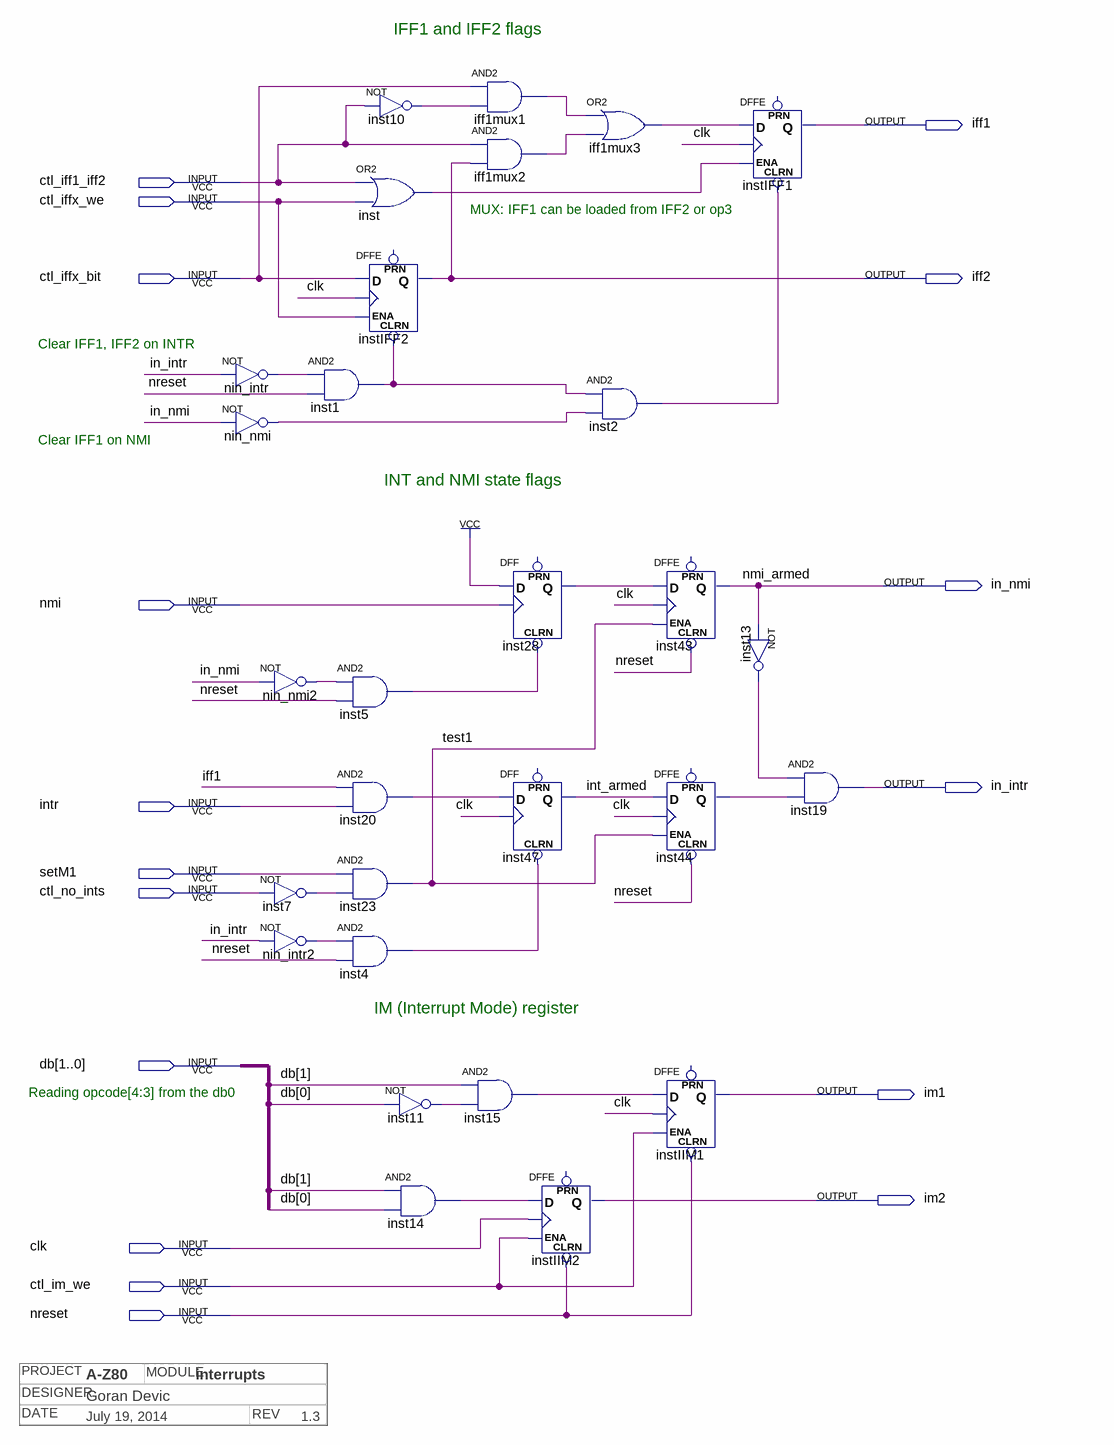
[diagram p0: schematic sheet]
// Quartus schematic interrupts.bdf as structural Verilog: 29 symbols, 17 pins
// Title block: PROJECT: A-Z80; MODULE: interrupts; DESIGNER: Goran Devic; DATE: July 19, 2014; REV: 1.3
module interrupts (
  input  ctl_iff1_iff2,
  input  ctl_iffx_we,
  input  ctl_iffx_bit,
  input  nmi,
  input  intr,
  input  setM1,
  input  ctl_no_ints,
  input  [1:0] db,
  input  clk,
  input  ctl_im_we,
  input  nreset,
  output iff1,
  output iff2,
  output in_nmi,
  output in_intr,
  output im1,
  output im2
);

  wire iff1mux1_out, iff1mux2_out, iff1mux3_out, inst1_out, inst2_out, inst4_out, inst5_out, inst7_out,
       inst10_out, inst11_out, inst13_out, inst14_out, inst15_out, inst20_out, inst44_q, inst_out, int_armed,
       nin_intr2_out, nin_intr_out, nin_nmi2_out, nin_nmi_out, nmi_armed, test1;

  not nin_intr (nin_intr_out, in_intr);
  not nin_nmi (nin_nmi_out, in_nmi);
  not nin_nmi2 (nin_nmi2_out, in_nmi);
  not inst7 (inst7_out, ctl_no_ints);
  not nin_intr2 (nin_intr2_out, in_intr);
  not inst10 (inst10_out, ctl_iff1_iff2);
  or inst (inst_out, ctl_iff1_iff2, ctl_iffx_we);
  DFFE instIFF2 (.CLRN(inst1_out), .D(ctl_iffx_bit), .CLK(clk), .ENA(ctl_iffx_we), .Q(iff2));  // open: PRN
  and inst1 (inst1_out, nin_intr_out, nreset);
  and inst5 (inst5_out, nin_nmi2_out, nreset);
  and inst20 (inst20_out, iff1, intr);
  and inst23 (test1, setM1, inst7_out);
  and inst4 (inst4_out, nin_intr2_out, nreset);
  not inst11 (inst11_out, db[0]);
  and inst14 (inst14_out, db[1], db[0]);
  and iff1mux1 (iff1mux1_out, ctl_iffx_bit, inst10_out);
  and iff1mux2 (iff1mux2_out, ctl_iff1_iff2, iff2);
  DFF inst28 (.CLRN(inst5_out), .CLK(nmi), .D(1'b1), .Q(nmi_armed));  // open: PRN
  DFF inst47 (.CLRN(inst4_out), .CLK(clk), .D(inst20_out), .Q(int_armed));  // open: PRN
  and inst15 (inst15_out, db[1], inst11_out);
  or iff1mux3 (iff1mux3_out, iff1mux1_out, iff1mux2_out);
  and inst2 (inst2_out, inst1_out, nin_nmi_out);
  DFFE instIIM2 (.CLRN(nreset), .D(inst14_out), .CLK(clk), .ENA(ctl_im_we), .Q(im2));  // open: PRN
  DFFE inst43 (.CLRN(nreset), .D(nmi_armed), .CLK(clk), .ENA(test1), .Q(in_nmi));  // open: PRN
  DFFE inst44 (.CLRN(nreset), .D(int_armed), .CLK(clk), .ENA(test1), .Q(inst44_q));  // open: PRN
  DFFE instIIM1 (.CLRN(nreset), .D(inst15_out), .CLK(clk), .ENA(ctl_im_we), .Q(im1));  // open: PRN
  DFFE instIFF1 (.CLRN(inst2_out), .D(iff1mux3_out), .CLK(clk), .ENA(inst_out), .Q(iff1));  // open: PRN
  not inst13 (inst13_out, in_nmi);
  and inst19 (in_intr, inst13_out, inst44_q);

  // Notes on the sheet:
  //   IFF1 and IFF2 flags
  //   MUX: IFF1 can be loaded from IFF2 or op3
  //   Clear IFF1, IFF2 on INTR
  //   Clear IFF1 on NMI
  //   INT and NMI state flags
  //   IM (Interrupt Mode) register
  //   Reading opcode[4:3] from the db0
endmodule
